# EAGLE design injection-feedforward (EAGLE 6.6.0)
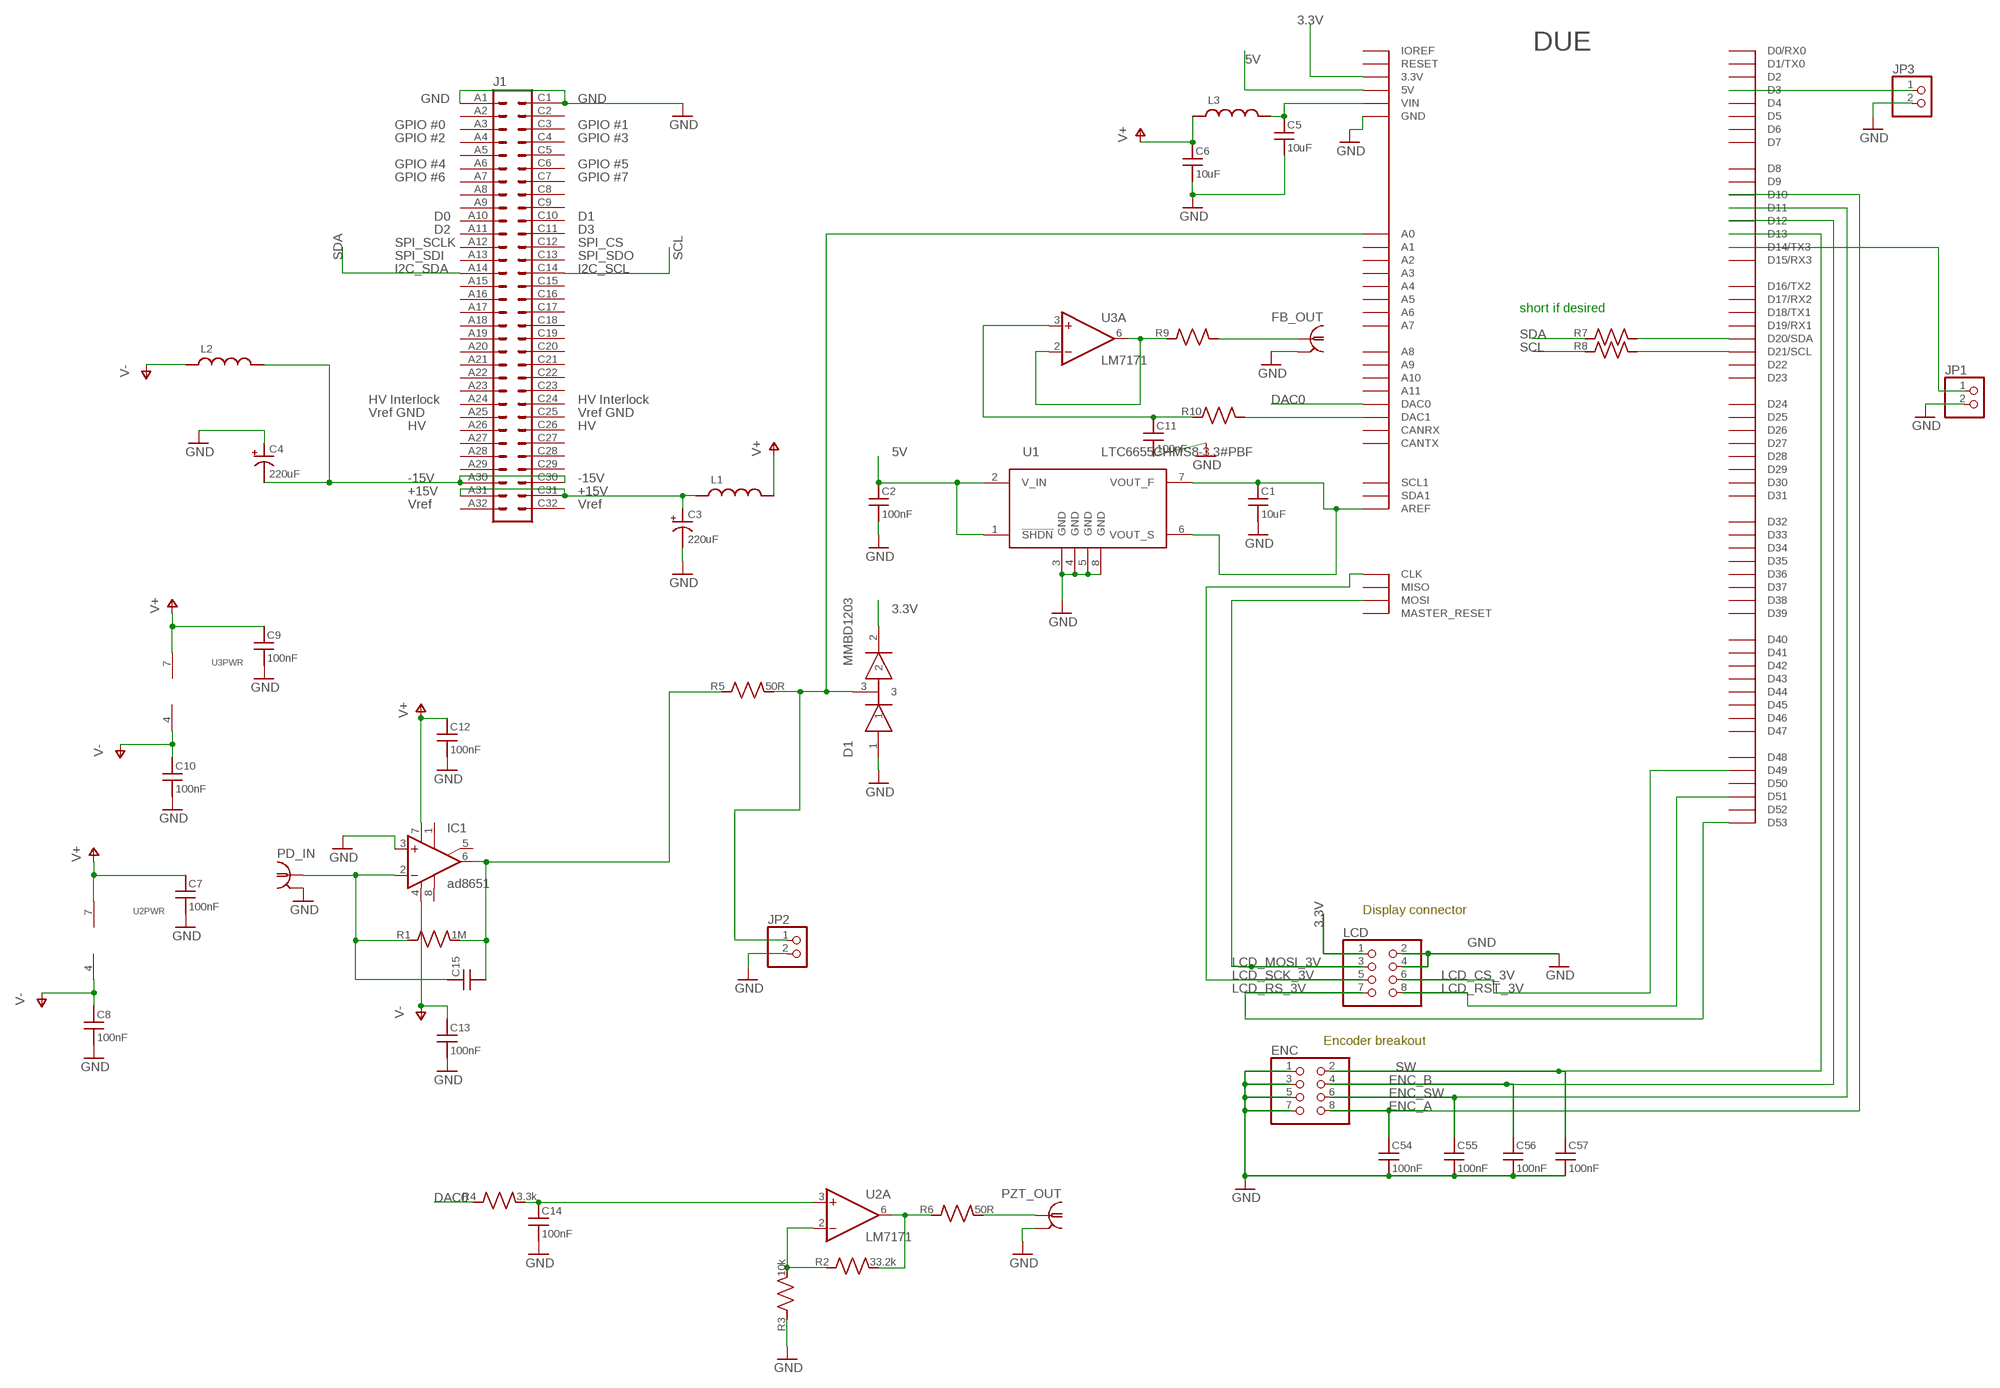
[diagram p0: schematic, sheet 1]

## Parts
C1  10uF  C_MLCC_SMDCMLCC_0805  [C_MLCC_0805]
C2  100nF  C_MLCC_SMDCMLCC_0603  [C_MLCC_0603]
C3  220uF  C_POL_SMDF  [PANASONIC_F]
C4  220uF  C_POL_SMDF  [PANASONIC_F]
C5  10uF  C_MLCC_SMDCMLCC_0805  [C_MLCC_0805]
C6  10uF  C_MLCC_SMDCMLCC_0805  [C_MLCC_0805]
C7  100nF  C_MLCC_SMDCMLCC_0603  [C_MLCC_0603]
C8  100nF  C_MLCC_SMDCMLCC_0603  [C_MLCC_0603]
C9  100nF  C_MLCC_SMDCMLCC_0603  [C_MLCC_0603]
C10  100nF  C_MLCC_SMDCMLCC_0603  [C_MLCC_0603]
C11  100nF  C_MLCC_SMDCMLCC_0603  [C_MLCC_0603]
C12  100nF  C_MLCC_SMDCMLCC_0603  [C_MLCC_0603]
C13  100nF  C_MLCC_SMDCMLCC_0603  [C_MLCC_0603]
C14  100nF  C_MLCC_SMDCMLCC_0603  [C_MLCC_0603]
C15  C_MLCC_SMDCMLCC_0603  [C_MLCC_0603]
C54  100nF  C_MLCC_SMDCMLCC_0603  [C_MLCC_0603]
C55  100nF  C_MLCC_SMDCMLCC_0603  [C_MLCC_0603]
C56  100nF  C_MLCC_SMDCMLCC_0603  [C_MLCC_0603]
C57  100nF  C_MLCC_SMDCMLCC_0603  [C_MLCC_0603]
D1  MMBD1203  [SOT23]
ENC  PINHD-2X4-SHROUD  [ML08]
FB_OUT  BNC-H  [BNC90]
IC1  ad8651  OPAMP-SO  [SO08]
J1  VG64C  [VG64-CUTOUT]
JP1  PINHD-1X2  [1X02]
JP2  PINHD-1X2  [1X02]
JP3  PINHD-1X2  [1X02]
L1  L_FERRITE_SMDLFERRITE_0603  [L_FERRITE_0603]
L2  L_FERRITE_SMDLFERRITE_0603  [L_FERRITE_0603]
L3  L_FERRITE_SMDLFERRITE_0603  [L_FERRITE_0603]
LCD  PINHD-2X4-SHROUD  [ML08]
PD_IN  BNC-H  [BNC90]
PZT_OUT  BNC-H  [BNC90]
R1  1M  R_SMDR0603  [R_0603]
R2  33.2k  R_SMDR0603  [R_0603]
R3  10k  R_SMDR0603  [R_0603]
R4  3.3k  R_SMDR0603  [R_0603]
R5  50R  R_SMDR0603  [R_0603]
R6  50R  R_SMDR0603  [R_0603]
R7  R_SMDR0603  [R_0603]
R8  R_SMDR0603  [R_0603]
R9  R_SMDR0603  [R_0603]
R10  R_SMDR0603  [R_0603]
U1  LTC6655CHMS8-3.3#PBF  [MSOP8]
U2  LM7171  [SO08$1]
U3  LM7171  [SO08$1]
U$1  DUE_SHIELD  [DUE_SHIELD]

## Nets
3.3V: D1.2 LCD.1 U$1.3.3(3.3V)
5V: C2.P$1 U1.1(!SHDN) U1.2(V_IN) U$1.5V0(5V) U$1.5V1(5V) U$1.5V2(5V) U$1.5V3(5V)
DAC0: R4.P$1 U$1.DAC0
ENC_A: C54.P$1 ENC.8 U$1.10(D10)
ENC_B: C56.P$1 ENC.4 U$1.12(D12)
ENC_SW: C55.P$1 ENC.6 U$1.11(D11)
GND: C1.P$2 C2.P$2 C3.- C4.+ C5.P$2 C6.P$2 C7.P$2 C8.P$2 C9.P$2 C10.P$2 C11.P$2 C12.P$2 C13.P$2 C14.P$2 C54.P$2 C55.P$2 C56.P$2 C57.P$2 D1.1 ENC.1 ENC.3 ENC.5 ENC.7 FB_OUT.2 IC1.3(+IN) J1.A1 J1.C1 JP1.2 JP2.2 JP3.2 LCD.2 LCD.4 PD_IN.2 PZT_OUT.2 R3.P$1 U1.3(GND) U1.4(GND) U1.5(GND) U1.8(GND) U$1.GND U$1.GND0(GND) U$1.GND1(GND) U$1.GND2(GND) U$1.GND3(GND) U$1.GND4(GND)
LCD_CS_3V: LCD.6 U$1.49(D49)
LCD_MOSI_3V: LCD.3 U$1.MOSI
LCD_RS_3V: LCD.7 U$1.53(D53)
LCD_RST_3V: LCD.8 U$1.51(D51)
LCD_SCK_3V: LCD.5 U$1.CLK
N$1: C1.P$1 U1.6(VOUT_S) U1.7(VOUT_F) U$1.AREF
N$2: C3.+ J1.A31 J1.C31 L1.P$1
N$3: C4.- J1.A30 J1.C30 L2.P$2
N$4: R7.P$2 U$1.20(D20/SDA)
N$5: R9.P$1 U3.2(A:-IN) U3.6(A:OUT)
N$6: C5.P$1 L3.P$2 U$1.VIN
N$7: R2.P$1 R3.P$2 U2.2(A:-IN)
N$8: R2.P$2 R6.P$1 U2.6(A:OUT)
N$9: C15.P$1 IC1.2(-IN) PD_IN.1 R1.P$1
N$10: C15.P$2 IC1.6(OUT) R1.P$2 R5.P$1
N$11: C14.P$1 R4.P$2 U2.3(A:+IN)
N$12: JP1.1 U$1.14(D14/TX3)
N$13: D1.3 JP2.1 R5.P$2 U$1.A0
N$14: PZT_OUT.1 R6.P$2
N$15: R8.P$2 U$1.21(D21/SCL)
N$16: FB_OUT.1 R9.P$2
N$17: C11.P$1 R10.P$1 U3.3(A:+IN)
N$18: R10.P$2 U$1.DAC1
N$20: JP3.1 U$1.3(D3)
SCL: J1.C14 R8.P$1
SDA: J1.A14 R7.P$1
SW: C57.P$1 ENC.2 U$1.13(D13)
V+: C6.P$1 C7.P$1 C9.P$1 C12.P$1 IC1.7(V+) L1.P$2 L3.P$1 U2.7(PWR:V+) U3.7(PWR:V+)
V-: C8.P$1 C10.P$1 C13.P$1 IC1.4(V-) L2.P$1 U2.4(PWR:V-) U3.4(PWR:V-)
Unconnected: IC1.1(ON1) IC1.5(ON2) IC1.8(OPT) J1.A2 J1.A3 J1.A4 J1.A5 J1.A6 J1.A7 J1.A8 J1.A9 J1.A10 J1.A11 J1.A12 J1.A13 J1.A15 J1.A16 J1.A17 J1.A18 J1.A19 J1.A20 J1.A21 J1.A22 J1.A23 J1.A24 J1.A25 J1.A26 J1.A27 J1.A28 J1.A29 J1.A32 J1.C2 J1.C3 J1.C4 J1.C5 J1.C6 J1.C7 J1.C8 J1.C9 J1.C10 J1.C11 J1.C12 J1.C13 J1.C15 J1.C16 J1.C17 J1.C18 J1.C19 J1.C20 J1.C21 J1.C22 J1.C23 J1.C24 J1.C25 J1.C26 J1.C27 J1.C28 J1.C29 J1.C32 U$1.0(D0/RX0) U$1.1(D1/TX0) U$1.2(D2) U$1.4(D4) U$1.5(D5) U$1.6(D6) U$1.7(D7) U$1.8(D8) U$1.9(D9) U$1.15(D15/RX3) U$1.16(D16/TX2) U$1.17(D17/RX2) U$1.18(D18/TX1) U$1.19(D19/RX1) U$1.22(D22) U$1.23(D23) U$1.24(D24) U$1.25(D25) U$1.26(D26) U$1.27(D27) U$1.28(D28) U$1.29(D29) U$1.30(D30) U$1.31(D31) U$1.32(D32) U$1.33(D33) U$1.34(D34) U$1.35(D35) U$1.36(D36) U$1.37(D37) U$1.38(D38) U$1.39(D39) U$1.40(D40) U$1.41(D41) U$1.42(D42) U$1.43(D43) U$1.44(D44) U$1.45(D45) U$1.46(D46) U$1.47(D47) U$1.48(D48) U$1.50(D50) U$1.52(D52) U$1.A1 U$1.A2 U$1.A3 U$1.A4 U$1.A5 U$1.A6 U$1.A7 U$1.A8 U$1.A9 U$1.A10 U$1.A11 U$1.CANRX U$1.CANTX U$1.IOREF U$1.MASTER_RESET U$1.MISO U$1.RESET U$1.SCL1 U$1.SDA1

## Notes on the sheet
- short if desired
- Display connector
- Encoder breakout

## Library data of the parts
C1 C2 C5-C15 = jqi_passives:C_MLCC_SMD
C3 C4 = jqi_passives:C_POL_SMD
C54-C57 = jqi_passives:C_MLCC_SMD; PARTNO: 1276-1936-1-ND
D1 = semiconductor-jqi:MMBD1203
ENC LCD = mcu-accessories:PINHD-2X4: PIN HEADER; PARTNO: 609-3530-ND
FB_OUT PD_IN PZT_OUT = connector-jqi:BNC: BNC Connector.; DIGIKEY: A32260-ND
IC1 = opamp-jqi:OPAMP: Basic Op Amp. Be sure to check actual pinout of your device, and modify as necessary!
J1 = connector-jqi:VG64: PCB EUROCARD, 64-pin type C/AC, 2.54 mm Typically use package VG64P.
JP1-JP3 = pinhead:PINHD-1X2: PIN HEADER
L1-L3 = jqi_passives:L_FERRITE_SMD
R1-R10 = jqi_passives:R_SMD
U1 = regulator-jqi:LTC6655CHMS8-3.3#PBF
U2 U3 = Eurocard-HV-piezo-driver:LM7171: High speed, high output current OpAmp (Texas Instruments) 200MHz; 100mA output current; 4100V/us slew, 85dB open-loop gain.; PN: LM7171BIMX/NOPBCT-ND
U$1 = arduino-jqi:DUE_SHIELD

## Board
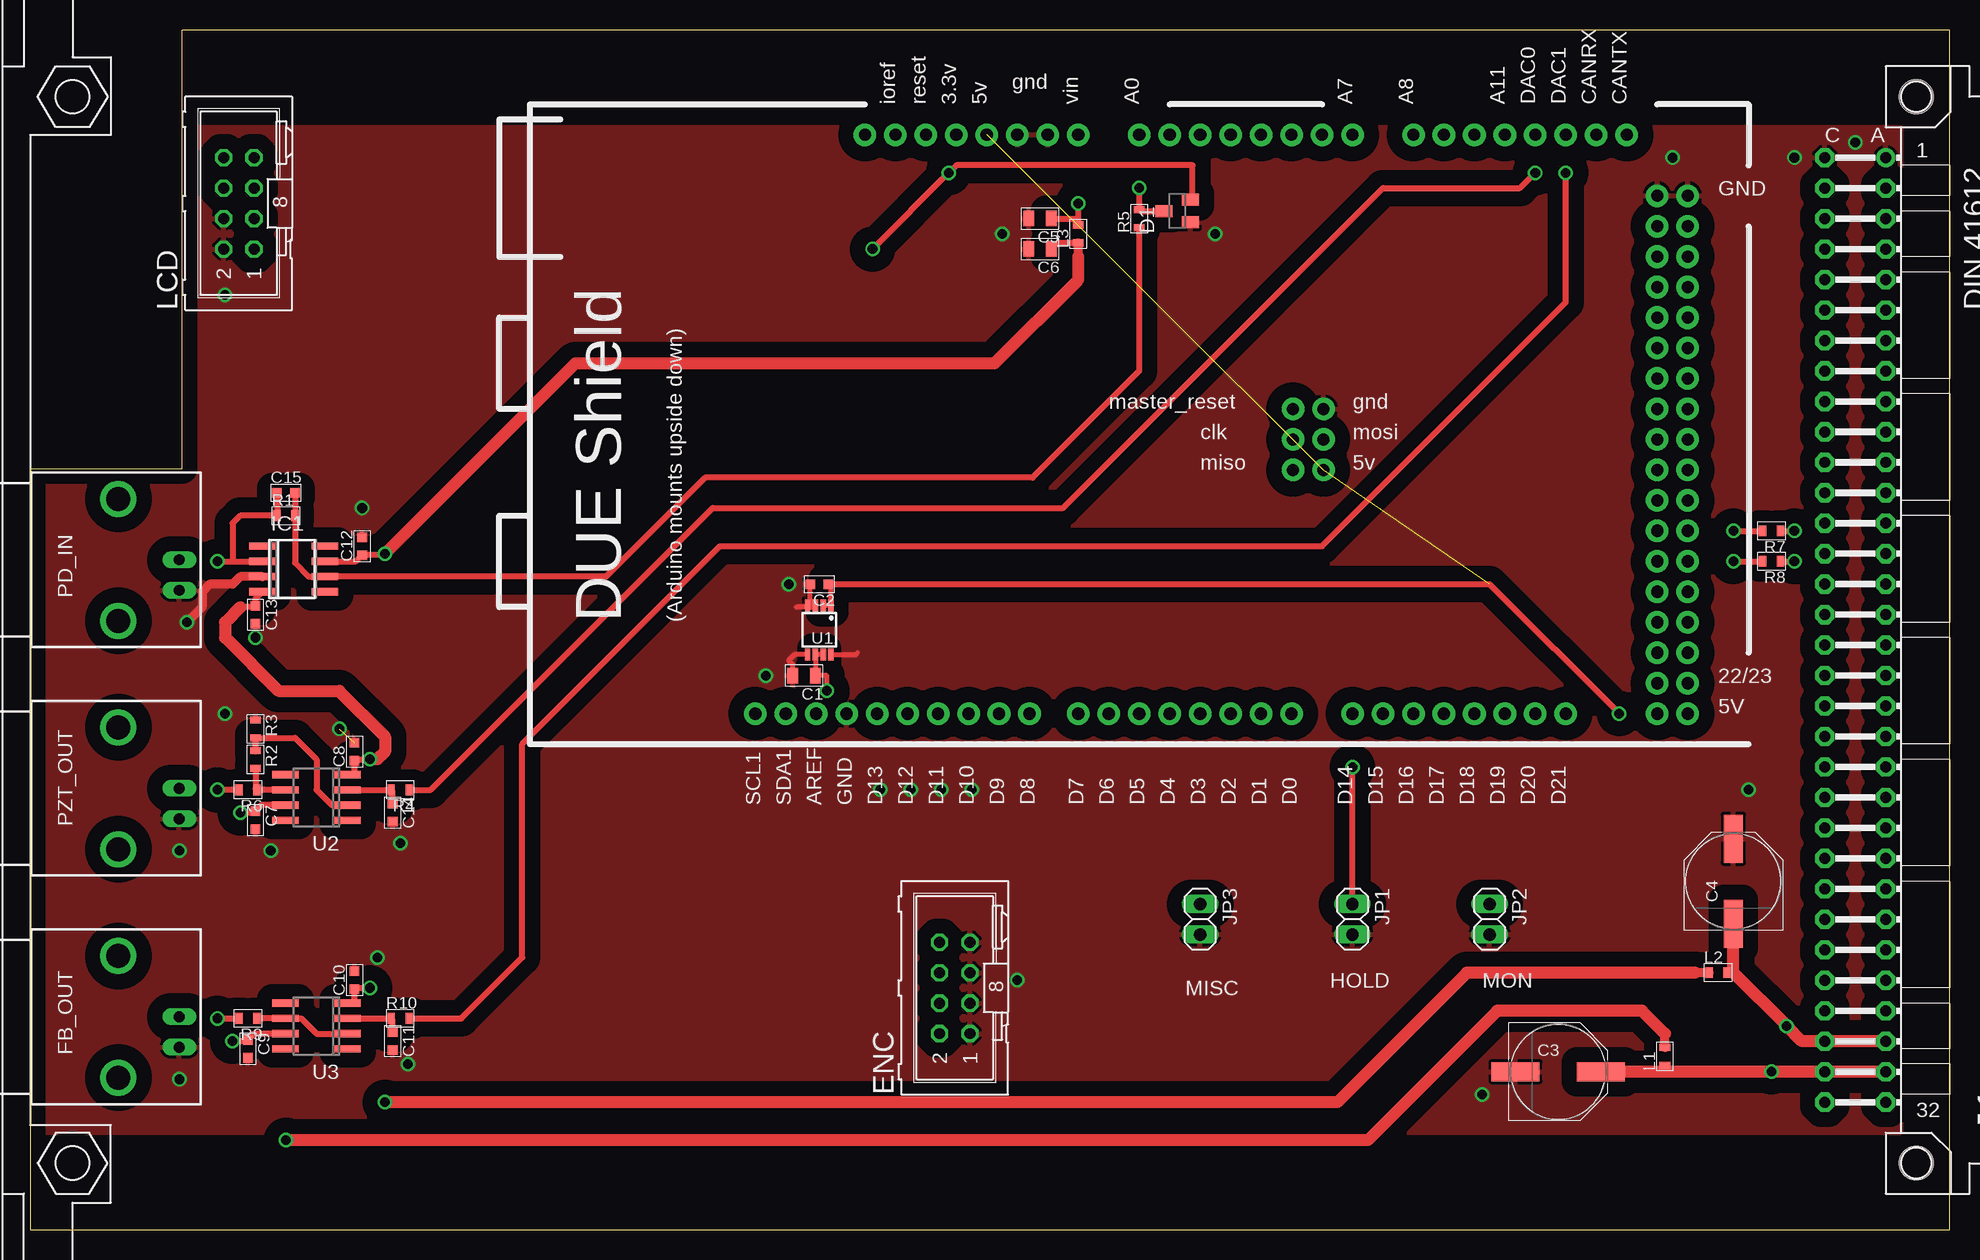
[diagram p1: board, top side]
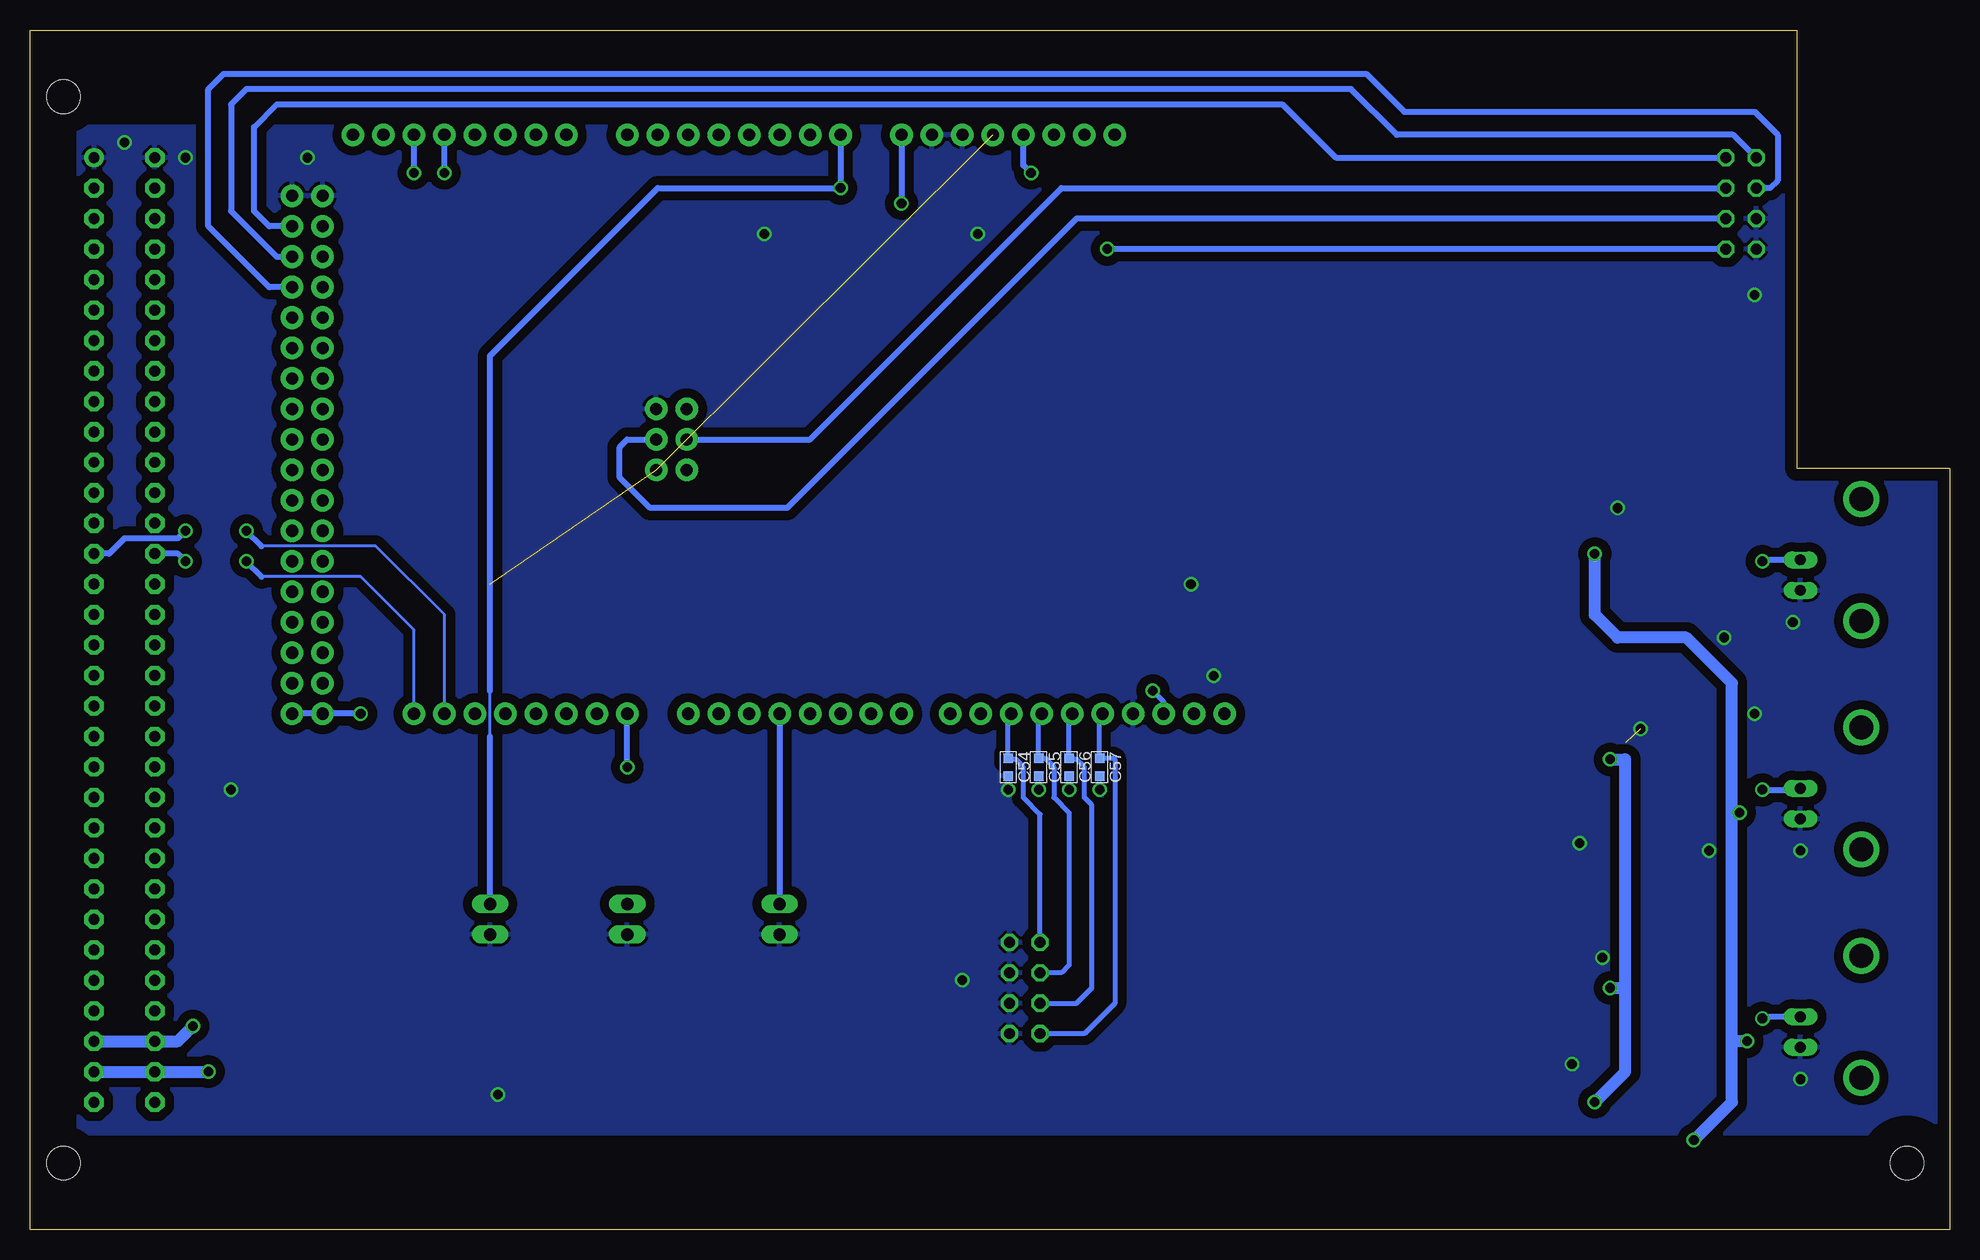
[diagram p2: board, bottom side, seen from below]

Size 160.02 x 100.03 mm. Coordinates in mm from the lower left corner, seen from the top.
Copper layers (1*16): Top 0.035mm / dielectric 1.5mm / Bottom 0.035mm
Design rules "default": minimum track width 10mil, minimum drill 24mil, track to track 8mil, track to pad 8mil, pad to pad 8mil, via to via 8mil, smd to smd 8mil, copper to edge 40mil, drill to drill 8mil, minimum pad ring 10mil, minimum via ring 8mil, stop-mask expansion 4mil, vias tented up to drill 0mil, thermal gap 10mil

### Footprints (pad centres in the part's own frame; a part is rotated, then mirrored left to right if it is on the bottom)
C_MLCC_0805 = smd 0.9 x 1.3: P$1 -0.95,0; P$2 0.95,0
C_MLCC_0603 = smd 0.8 x 0.8: P$1 -0.75,0; P$2 0.75,0
PANASONIC_F = smd 4 x 1.6: + 3.55,0; - -3.55,0
SOT23 = smd 1 x 1.4: 1 -0.95,-1.1; 2 0.95,-1.1; 3 0,1.1
ML08 = drill 0.914 octagon: 1 -3.81,-1.143; 2 -3.81,1.397; 3 -1.27,-1.143; 4 -1.27,1.397; 5 1.27,-1.143; 6 1.27,1.397; 7 3.81,-1.143; 8 3.81,1.397
BNC90 = drill 0.9 pad 1.27 long: 1 0,-5.08; 2 -2.54,-5.08 | drill 2 pad 2.032: ANCHOR1 -5.08,0; ANCHOR2 5.08,0
SO08 = smd 2.2 x 0.6: 1 -2.6,1.27; 2 -2.6,0; 3 -2.6,-1.27; 4 -2.6,-2.54; 5 2.6,-2.54; 6 2.6,-1.27; 7 2.6,0; 8 2.6,1.27
VG64-CUTOUT = drill 0.914 pad 1.6: A1 154.94,35.56 | drill 0.914 pad 1.6 octagon: A2 154.94,33.02; A3 154.94,30.48; A4 154.94,27.94; A5 154.94,25.4; A6 154.94,22.86; A7 154.94,20.32; A8 154.94,17.78; A9 154.94,15.24; A10 154.94,12.7; A11 154.94,10.16; A12 154.94,7.62; A13 154.94,5.08; A14 154.94,2.54; A15 154.94,0; A16 154.94,-2.54; A17 154.94,-5.08; A18 154.94,-7.62; A19 154.94,-10.16; A20 154.94,-12.7; A21 154.94,-15.24; A22 154.94,-17.78; A23 154.94,-20.32; A24 154.94,-22.86; A25 154.94,-25.4; A26 154.94,-27.94; A27 154.94,-30.48; A28 154.94,-33.02; A29 154.94,-35.56; A30 154.94,-38.1; A31 154.94,-40.64; A32 154.94,-43.18; C1 149.86,35.56; C2 149.86,33.02; C3 149.86,30.48; C4 149.86,27.94; C5 149.86,25.4; C6 149.86,22.86; C7 149.86,20.32; C8 149.86,17.78; C9 149.86,15.24; C10 149.86,12.7; C11 149.86,10.16; C12 149.86,7.62; C13 149.86,5.08; C14 149.86,2.54; C15 149.86,0; C16 149.86,-2.54; C17 149.86,-5.08; C18 149.86,-7.62; C19 149.86,-10.16; C20 149.86,-12.7; C21 149.86,-15.24; C22 149.86,-17.78; C23 149.86,-20.32; C24 149.86,-22.86; C25 149.86,-25.4; C26 149.86,-27.94; C27 149.86,-30.48; C28 149.86,-33.02; C29 149.86,-35.56; C30 149.86,-38.1; C31 149.86,-40.64; C32 149.86,-43.18 | hole 2.794: 3.81,-48.26; 157.48,40.64; 157.48,-48.26
1X02 = drill 1.016 long: 1 -1.27,0; 2 1.27,0
L_FERRITE_0603 = smd 0.6 x 0.9: P$1 -0.75,0; P$2 0.75,0
R_0603 = smd 0.6 x 0.9: P$1 -0.75,0; P$2 0.75,0
MSOP8 = smd 0.45 x 1: 1 -0.975,-2.05; 2 -0.325,-2.05; 3 0.325,-2.05; 4 0.975,-2.05; 5 0.975,2.05; 6 0.325,2.05; 7 -0.325,2.05; 8 -0.975,2.05
SO08$1 = smd 2.2 x 0.6: 1 -2.6,1.27; 2 -2.6,0; 3 -2.6,-1.27; 4 -2.6,-2.54; 5 2.6,-2.54; 6 2.6,-1.27; 7 2.6,0; 8 2.6,1.27
DUE_SHIELD = drill 1.016 pad 1.88: 0 -33.02,0; 1 -35.56,0; 2 -38.1,0; 3 -40.64,0; 3.3 -60.96,48.26; 4 -43.18,0; 5 -45.72,0; 5V0 -2.54,0; 5V1 0,0; 5V2 -58.42,48.26; 5V3 -30.353,20.32; 6 -48.26,0; 7 -50.8,0; 8 -54.864,0; 9 -57.404,0; 10 -59.944,0; 11 -62.484,0; 12 -65.024,0; 13 -67.564,0; 14 -27.94,0; 15 -25.4,0; 16 -22.86,0; 17 -20.32,0; 18 -17.78,0; 19 -15.24,0; 20 -12.7,0; 21 -10.16,0; 22 -2.54,2.54; 23 0,2.54; 24 -2.54,5.08; 25 0,5.08; 26 -2.54,7.62; 27 0,7.62; 28 -2.54,10.16; 29 0,10.16; 30 -2.54,12.7; 31 0,12.7; 32 -2.54,15.24; 33 0,15.24; 34 -2.54,17.78; 35 0,17.78; 36 -2.54,20.32; 37 0,20.32; 38 -2.54,22.86; 39 0,22.86; 40 -2.54,25.4; 41 0,25.4; 42 -2.54,27.94; 43 0,27.94; 44 -2.54,30.48; 45 0,30.48; 46 -2.54,33.02; 47 0,33.02; 48 -2.54,35.56; 49 0,35.56; 50 -2.54,38.1; 51 0,38.1; 52 -2.54,40.64; 53 0,40.64; A0 -45.72,48.26; A1 -43.18,48.26; A2 -40.64,48.26; A3 -38.1,48.26; A4 -35.56,48.26; A5 -33.02,48.26; A6 -30.48,48.26; A7 -27.94,48.26; A8 -22.86,48.26; A9 -20.32,48.26; A10 -17.78,48.26; A11 -15.24,48.26; AREF -72.644,0; CANRX -7.62,48.26; CANTX -5.08,48.26; CLK -32.893,22.86; DAC0 -12.7,48.26; DAC1 -10.16,48.26; GND -30.353,25.4; GND0 -70.104,0; GND1 0,43.18; GND2 -2.54,43.18; GND3 -55.88,48.26; GND4 -53.34,48.26; IOREF -66.04,48.26; MASTER_RESET -32.893,25.4; MISO -32.893,20.32; MOSI -30.353,22.86; P$1 -68.58,48.26; RESET -63.5,48.26; SCL1 -77.724,0; SDA1 -75.184,0; VIN -50.8,48.26

### Placement (x,y rotation side)
C1  64.52,46.2 180 top
C2  65.79,53.82 180 top
C3  127.38,13.18 0 top
C4  141.99,29.06 90 top
C5  84.2,84.3 180 top
C6  84.2,81.76 180 top
C7  18.8,34.14 270 top
C8  27.05,39.85 90 top
C9  18.16,15.09 270 top
C10  27.05,20.8 90 top
C11  30.23,15.72 270 top
C12  27.69,57 90 top
C13  18.8,51.28 270 top
C14  30.23,34.77 270 top
C15  21.34,61.44 0 top
C54  78.49,38.58 270 bottom
C55  75.95,38.58 270 bottom
C56  73.41,38.58 270 bottom
C57  70.87,38.58 270 bottom
D1  95.63,84.94 90 top
ENC  77.22,20.17 90 top
FB_OUT  7.37,17.75 90 top
IC1  21.97,55.73 0 top
J1  -0.25,53.82 0 top
JP1  110.24,25.88 270 top
JP2  121.67,25.88 270 top
JP3  97.54,25.88 270 top
L1  136.27,14.45 90 top
L2  140.72,21.44 0 top
L3  87.38,83.03 90 top
LCD  17.53,85.57 90 top
PD_IN  7.37,55.85 90 top
PZT_OUT  7.37,36.8 90 top
R1  21.34,59.54 0 top
R2  18.8,39.22 270 top
R3  18.8,41.76 270 top
R4  30.86,36.68 180 top
R5  92.46,84.3 90 top
R6  18.16,36.68 180 top
R7  145.16,58.27 180 top
R8  145.16,55.73 180 top
R9  18.16,17.63 180 top
R10  30.86,17.63 0 top
U1  65.79,50.01 180 top
U2  23.88,35.41 180 top
U3  23.88,16.36 180 top
U$1  138.18,43.03 0 top

### Tracks (layer width: path | path; a pad name or v marks a point on that pad's centre or on a via)
3.3V  (via drill 0.8)
  Top 0.508: v70.23,81.76 v76.58,88.11 77.22,88.75 96.9,88.75 96.9,86.06 D1.2
  Bottom 0.508: LCD.1 v70.23,81.76 | v76.58,88.11 77.22,88.75 U$1.3.3
5V  (via drill 0.8)  (2 unrouted)
  Top 0.406: C2.P$1 66.76,53.6 U1.1 U1.2
  Top 0.508: C2.P$1 121.67,53.82 v132.46,43.03
  Bottom 0.508: v132.46,43.03 U$1.5V0 U$1.5V1
DAC0  (via drill 0.8)
  Top 0.508: R4.P$1 33.4,36.68 56.9,60.17 86.11,60.17 112.78,86.84 124.21,86.84 v125.48,88.11
  Bottom 0.508: v125.48,88.11 U$1.DAC0
ENC_A
  Bottom 0.406: ENC.8 75.82,34.65 77.22,36.04 77.22,38.58 77.85,39.22 78.37,39.22 C54.P$1 78.49,42.77 U$1.10
ENC_B
  Bottom 0.406: ENC.4 72.77,18.9 71.5,20.17 71.5,35.41 72.14,36.04 72.14,38.58 72.77,39.22 73.29,39.22 C56.P$1 73.41,42.77 U$1.12
ENC_SW
  Bottom 0.406: ENC.6 74.04,21.44 73.41,22.07 73.41,34.77 74.68,36.04 74.68,38.58 75.43,39.33 C55.P$1 75.95,42.77 U$1.11
GND  (via drill 0.8)  (1 unrouted)
  Top 0.406: U1.8 68.82,47.96 68.96,48.11 | U1.5 63.74,47.96 63.25,47.47 63.57,47.15 C1.P$2 | U1.3 U1.4 64.67,51.92 | 64.67,51.92 63.88,51.92 | 64.67,51.92 65.15,51.92 65.04,52.03 C2.P$2
  Top 0.762: IC1.3 17.53,54.46 16.89,53.82 14.99,53.82 14.35,53.19 14.35,51.92 v13.08,50.65
  other vias: 82.3,20.8 31.5,13.82 28.96,22.71 30.86,32.23 20.07,31.6 16.26,43.03 27.69,60.17 18.8,49.38 61.34,46.2 63.25,53.82 143.26,36.68 121.03,11.28 152.15,90.65 147.07,89.38 136.91,89.38 98.81,83.03 81.03,83.03 12.45,31.6 12.45,12.55 25.78,41.76 16.26,77.95 70.87,36.68 73.41,36.68 75.95,36.68 78.49,36.68
  pour Bottom (isolate 0.762): 1.02,91.92 155.96,91.92 155.96,8.1 1.02,8.1
  pour Top (isolate 1.27): 1.02,91.92 155.96,91.92 155.96,8.1 1.02,8.1
LCD_CS_3V
  Bottom 0.508: U$1.49 140.08,78.59 145.16,83.67 145.16,95.1 143.89,96.37 48.64,96.37 45.47,93.19 16.26,93.19 14.35,91.29 14.35,87.48 14.99,86.84 LCD.6
LCD_MOSI_3V
  Bottom 0.508: LCD.3 72.77,84.3 96.9,60.17 108.33,60.17 110.87,62.71 110.87,65.25 110.24,65.89 U$1.MOSI
LCD_RS_3V
  Bottom 0.508: U$1.53 140.08,83.67 141.35,84.94 141.35,91.92 139.45,93.83 55.63,93.83 51.18,89.38 LCD.7
LCD_RST_3V
  Bottom 0.508: LCD.8 18.03,91.29 46.1,91.29 49.91,95.1 141.99,95.1 143.26,93.83 143.26,84.94 139.45,81.13 U$1.51
LCD_SCK_3V
  Bottom 0.508: U$1.CLK 95,65.89 74.04,86.84 LCD.5
N$1  (via drill 0.8)
  Top 0.406: v66.42,44.93 66.42,46.2 C1.P$1 U1.6 U1.7
  Bottom 0.406: U$1.AREF 65.53,44.04 v66.42,44.93
N$2  (via drill 0.8)
  Top 0.508: L1.P$1 136.27,13.18
  Top 1.016: J1.A31 J1.C31 v145.16,13.18 136.27,13.18 C3.+
  Bottom 1.016: J1.A31 J1.C31 v145.16,13.18
N$3  (via drill 0.8)
  Top 0.508: 141.99,21.44 L2.P$2
  Top 1.016: J1.A30 J1.C30 147.7,15.72 v146.43,16.99 141.99,21.44 C4.-
  Bottom 1.016: J1.A30 J1.C30 147.7,15.72 v146.43,16.99
N$4  (via drill 0.8)
  Top 0.508: v141.99,58.27 R7.P$2
  Bottom 0.254: U$1.20 125.48,51.28 131.19,57 140.72,57
  Bottom 0.508: 140.72,57 v141.99,58.27
N$5
  Top 0.508: R9.P$1 U3.6 22.61,17.63 23.88,16.36 U3.2
N$6  (via drill 0.8)
  Top 0.508: L3.P$2 87.38,84.3 | 87.38,84.3 v87.38,85.57 | C5.P$1 87.38,84.3
  Bottom 0.508: U$1.VIN v87.38,85.57
N$7
  Top 0.508: 18.8,39.85 R2.P$1 R3.P$2 22.09,41.01 23.88,39.22 23.88,36.68 25.15,35.41 U2.2
N$8
  Top 0.508: U2.6 R6.P$1 18.8,36.79 R2.P$2
N$9  (via drill 0.8)
  Top 0.508: v15.62,55.73 16.89,55.73 | 16.89,55.73 IC1.2 | 16.89,55.73 16.89,58.9 17.53,59.54 R1.P$1 C15.P$1
  Bottom 0.508: PD_IN.1 15.49,55.85 v15.62,55.73
N$10
  Top 0.508: R5.P$1 92.46,71.6 83.57,62.71 56.26,62.71 48.01,54.46 IC1.6 23.24,54.46 22.09,55.61 R1.P$2 C15.P$2
N$11
  Top 0.508: U2.3 R4.P$2 30.23,36.56 C14.P$1
N$12  (via drill 0.8)
  Top 0.508: JP1.1 v110.24,38.58
  Bottom 0.508: v110.24,38.58 U$1.14
N$13  (via drill 0.8)
  Top 0.508: D1.3 92.57,84.94 R5.P$2 v92.46,86.84
  Bottom 0.254: 121.67,41.12 121.67,44.93
  Bottom 0.508: U$1.A0 v92.46,86.84 107.7,86.84 121.67,72.87 121.67,44.93 | JP2.1 121.67,41.12
N$14  (via drill 0.8)
  Top 0.508: R6.P$2 v15.62,36.68
  Bottom 0.508: v15.62,36.68 12.57,36.68 PZT_OUT.1
N$15  (via drill 0.8)
  Top 0.508: v141.99,55.73 R8.P$2
  Bottom 0.254: U$1.21 128.02,50.01 132.46,54.46 140.72,54.46
  Bottom 0.508: 140.72,54.46 v141.99,55.73
N$16  (via drill 0.8)
  Top 0.508: v15.62,17.63 R9.P$2
  Bottom 0.508: FB_OUT.1 15.49,17.75 v15.62,17.63
N$17
  Top 0.508: U3.3 R10.P$1 30.23,17.51 C11.P$1
N$18  (via drill 0.8)
  Top 0.508: v128.02,88.11 128.02,77.32 107.7,57 57.53,57 41.02,40.49 41.02,22.71 35.94,17.63 R10.P$2
  Bottom 0.508: v128.02,88.11 U$1.DAC1
N$20
  Bottom 0.508: U$1.3 JP3.1
SCL  (via drill 0.8)
  Top 0.508: R8.P$1 v147.07,55.73
  Bottom 0.508: v147.07,55.73 147.7,56.36 J1.C14
SDA  (via drill 0.8)
  Top 0.508: R7.P$1 v147.07,58.27
  Bottom 0.508: v147.07,58.27 147.7,57.63 152.15,57.63 153.42,56.36 J1.A14
SW
  Bottom 0.406: ENC.2 72.14,16.36 69.6,18.9 69.6,39.22 69.71,39.33 C57.P$1 70.87,42.77 U$1.13
V+  (via drill 0.8)
  Top 0.508: IC1.7 27.17,55.73 C12.P$1 29.48,56.25 v29.59,56.36 | U2.7 19.32,35.41 C7.P$1 18.68,34.77 v17.53,34.77 | U3.7 18.68,16.36 C9.P$1 18.05,15.72 v16.89,15.72 | C6.P$1 85.67,82.28 L3.P$1
  Top 0.762: L1.P$2 136.27,16.36 | 87.38,81.13 L3.P$1
  Top 1.016: 136.27,16.36 134.37,18.26 122.3,18.26 111.51,7.47 v21.34,7.47 | v29.59,56.36 45.47,72.24 80.39,72.24 87.38,79.22 87.38,81.13
  Bottom 1.016: v21.34,7.47 18.16,10.64 18.16,15.72 | 18.16,15.72 18.16,34.77 | 18.16,34.77 18.16,45.57 21.97,49.38 27.69,49.38 29.59,51.28 v29.59,56.36 | v17.53,34.77 18.16,34.77 | v16.89,15.72 18.16,15.72
V-  (via drill 0.8)
  Top 0.508: IC1.4 18.8,52.61 C13.P$1 18.68,51.92 17.53,51.92 | U3.4 27.05,18.9 C10.P$1 27.05,20.17 v28.32,20.17 | U2.4 27.05,37.95 C8.P$1 27.17,39.22 v28.32,39.22
  Top 0.762: L2.P$1 138.81,21.44
  Top 1.016: 138.81,21.44 119.76,21.44 108.97,10.64 v29.59,10.64 | 17.53,51.92 16.26,50.65 16.26,49.38 20.7,44.93 25.78,44.93 29.59,41.12 29.59,39.85 28.96,39.22 v28.32,39.22
  Bottom 1.016: v29.59,10.64 27.05,13.18 27.05,20.17 | 27.05,20.17 27.05,39.22 v28.32,39.22 | v28.32,20.17 27.05,20.17

### Text on the board
tPlace: HOLD | MON | MISC